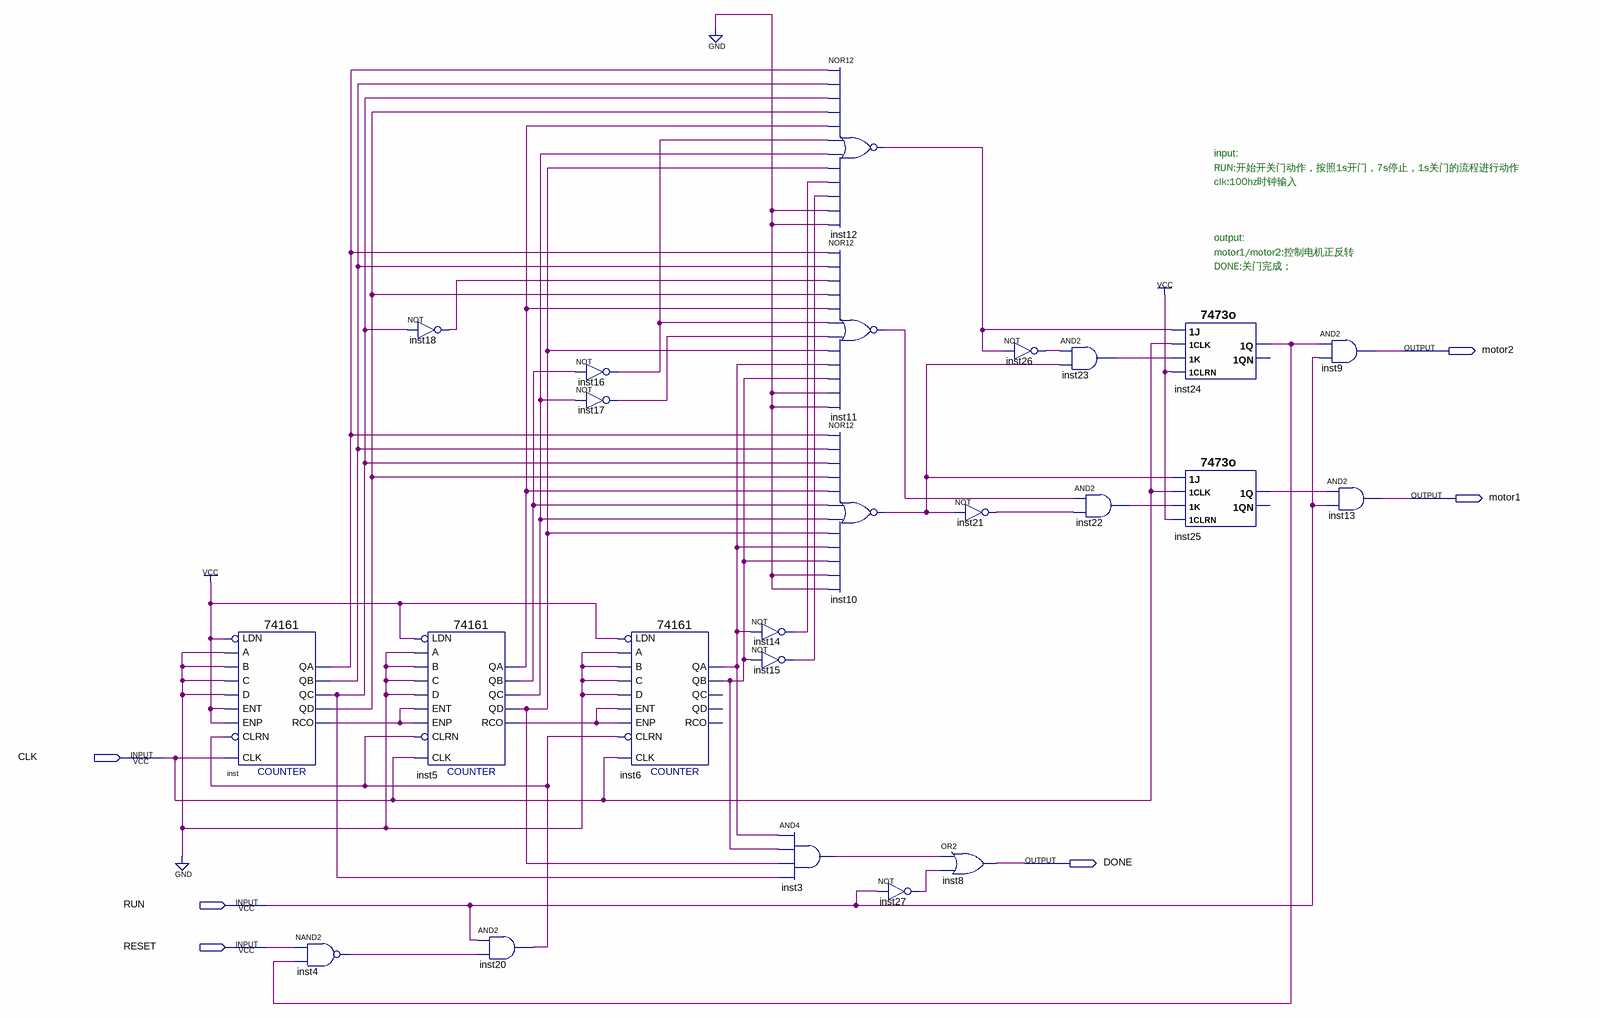
[diagram p0: schematic sheet]
// Quartus schematic doormotor.bdf as structural Verilog: 24 symbols, 6 pins
module doormotor (
  input  CLK,
  input  RUN,
  input  RESET,
  output motor2,
  output motor1,
  output DONE
);

  wire inst3_out, inst4_out, inst5_qa, inst5_qb, inst5_qc, inst5_qd, inst5_rco, inst6_qa, inst6_qb,
       inst10_out, inst11_out, inst12_out, inst14_out, inst15_out, inst16_out, inst17_out, inst18_out,
       inst20_out, inst21_out, inst22_out, inst23_out, inst24_1q, inst25_1q, inst26_out, inst27_out, inst_qa,
       inst_qb, inst_qc, inst_qd, inst_rco;

  \74161  inst (
    .CLRN(inst20_out), .CLK(CLK), .ENP(1'b1), .LDN(1'b1), .A(1'b0), .D(1'b0), .ENT(1'b1), .B(1'b0), .C(1'b0),
    .QD(inst_qd), .QC(inst_qc), .QB(inst_qb), .QA(inst_qa), .RCO(inst_rco));
  nand inst4 (inst4_out, RESET, inst24_1q);
  not inst18 (inst18_out, inst_qc);
  \74161  inst5 (
    .CLRN(inst20_out), .CLK(CLK), .ENP(inst_rco), .LDN(1'b1), .A(1'b0), .D(1'b0), .ENT(inst_rco), .B(1'b0),
    .C(1'b0), .QD(inst5_qd), .QC(inst5_qc), .QB(inst5_qb), .QA(inst5_qa), .RCO(inst5_rco));
  and inst20 (inst20_out, RUN, inst4_out);
  not inst16 (inst16_out, inst5_qb);
  not inst17 (inst17_out, inst5_qc);
  \74161  inst6 (
    .CLRN(inst20_out), .CLK(CLK), .ENP(inst5_rco), .LDN(1'b1), .A(1'b0), .D(1'b0), .ENT(inst5_rco), .B(1'b0),
    .C(1'b0), .QB(inst6_qb), .QA(inst6_qa));  // open: QD, QC, RCO
  not inst14 (inst14_out, inst6_qa);
  not inst15 (inst15_out, inst6_qb);
  and inst3 (inst3_out, inst6_qa, inst6_qb, inst5_qd, inst_qc);
  nor inst12 (inst12_out, inst_qa, inst_qb, inst_qc, inst_qd, inst5_qa, inst16_out, inst5_qc, inst5_qd, inst14_out, inst15_out, 1'b0, 1'b0);
  nor inst11 (inst11_out, inst_qa, inst_qb, inst18_out, inst_qd, inst5_qa, inst16_out, inst17_out, inst5_qd, inst6_qa, inst6_qb, 1'b0, 1'b0);
  nor inst10 (inst10_out, inst_qa, inst_qb, inst_qc, inst_qd, inst5_qa, inst5_qb, inst5_qc, inst5_qd, inst6_qa, inst6_qb, 1'b0, 1'b0);
  not inst27 (inst27_out, RUN);
  or inst8 (DONE, inst3_out, inst27_out);
  not inst26 (inst26_out, inst12_out);
  not inst21 (inst21_out, inst10_out);
  and inst23 (inst23_out, inst26_out, inst10_out);
  and inst22 (inst22_out, inst11_out, inst21_out);
  \7473o  inst24 (.\1J (inst12_out), .\1CLK (CLK), .\1CLRN (1'b1), .\1K (inst23_out), .\1Q (inst24_1q));  // open: 1QN
  \7473o  inst25 (.\1J (inst10_out), .\1CLK (CLK), .\1CLRN (1'b1), .\1K (inst22_out), .\1Q (inst25_1q));  // open: 1QN
  and inst9 (motor2, inst24_1q, RUN);
  and inst13 (motor1, inst25_1q, RUN);

  // Notes on the sheet:
  //   input:
  //   RUN:开始开关门动作，按照1s开门，7s停止，1s关门的流程进行动作
  //   clk:100hz时钟输入
  //   output:
  //   motor1/motor2:控制电机正反转
  //   DONE:关门完成；
endmodule
